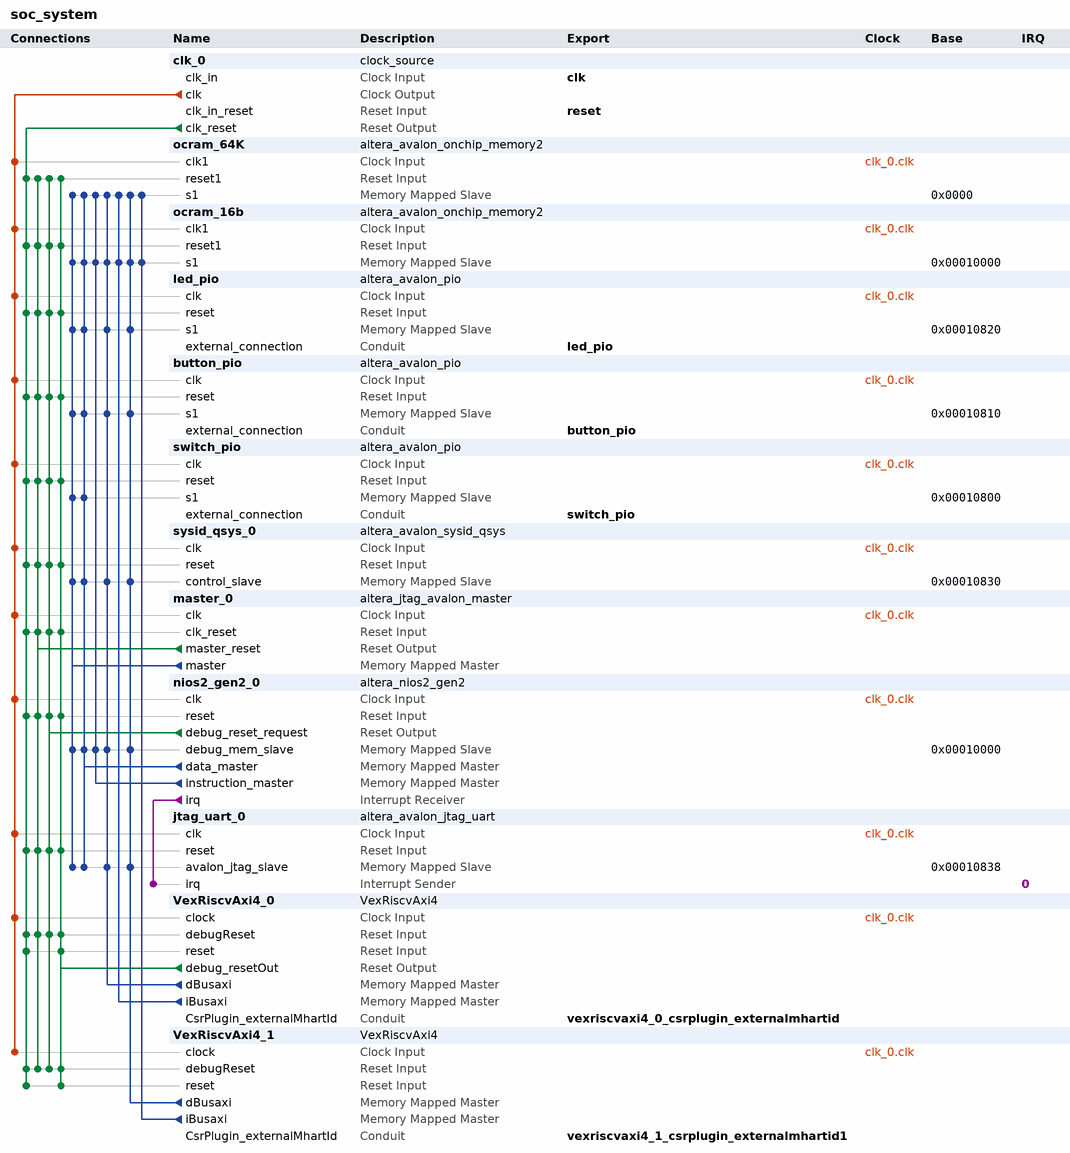
[diagram p0: system contents]
# Platform Designer (Qsys) system soc_system, Cyclone V 5CSEMA5F31C6
# Parameters at their usual value, and those the tool derives, are not listed.
package require -exact qsys 18.1
create_system soc_system
set_project_property DEVICE_FAMILY {Cyclone V}
set_project_property DEVICE 5CSEMA5F31C6

add_instance clk_0 clock_source 18.1
set_instance_parameter_value clk_0 clockFrequency 50000000

add_instance ocram_64K altera_avalon_onchip_memory2 18.1
set_instance_parameter_value ocram_64K dataWidth 32
set_instance_parameter_value ocram_64K dualPort false
set_instance_parameter_value ocram_64K initMemContent true
set_instance_parameter_value ocram_64K initializationFileName onchip_mem.hex
set_instance_parameter_value ocram_64K memorySize 65536

add_instance ocram_16b altera_avalon_onchip_memory2 18.1
set_instance_parameter_value ocram_16b dataWidth 32
set_instance_parameter_value ocram_16b dualPort false
set_instance_parameter_value ocram_16b initMemContent true
set_instance_parameter_value ocram_16b initializationFileName onchip_mem.hex
set_instance_parameter_value ocram_16b memorySize 16384

add_instance led_pio altera_avalon_pio 18.1
set_instance_parameter_value led_pio direction Output
set_instance_parameter_value led_pio width 4

add_instance button_pio altera_avalon_pio 18.1
set_instance_parameter_value button_pio direction Input
set_instance_parameter_value button_pio width 4

add_instance switch_pio altera_avalon_pio 18.1
set_instance_parameter_value switch_pio direction Input
set_instance_parameter_value switch_pio width 3

add_instance sysid_qsys_0 altera_avalon_sysid_qsys 18.1
set_instance_parameter_value sysid_qsys_0 id -569319920

add_instance master_0 altera_jtag_avalon_master 18.1

add_instance nios2_gen2_0 altera_nios2_gen2 18.1
set_instance_parameter_value nios2_gen2_0 dcache_size 2048
set_instance_parameter_value nios2_gen2_0 exceptionSlave ocram_64K.s1
set_instance_parameter_value nios2_gen2_0 icache_size 4096
set_instance_parameter_value nios2_gen2_0 impl Tiny
set_instance_parameter_value nios2_gen2_0 resetSlave ocram_64K.s1

add_instance jtag_uart_0 altera_avalon_jtag_uart 18.1
set_instance_parameter_value jtag_uart_0 simInteractiveOptions NO_INTERACTIVE_WINDOWS

add_instance VexRiscvAxi4_0 VexRiscvAxi4 1.0

add_instance VexRiscvAxi4_1 VexRiscvAxi4 1.0

# connections
add_connection clk_0.clk button_pio.clk clock
add_connection clk_0.clk jtag_uart_0.clk clock
add_connection clk_0.clk led_pio.clk clock
add_connection clk_0.clk master_0.clk clock
add_connection clk_0.clk nios2_gen2_0.clk clock
add_connection clk_0.clk ocram_16b.clk1 clock
add_connection clk_0.clk ocram_64K.clk1 clock
add_connection clk_0.clk switch_pio.clk clock
add_connection clk_0.clk sysid_qsys_0.clk clock
add_connection clk_0.clk VexRiscvAxi4_0.clock clock
add_connection clk_0.clk VexRiscvAxi4_1.clock clock
add_connection clk_0.clk_reset button_pio.reset reset
add_connection clk_0.clk_reset jtag_uart_0.reset reset
add_connection clk_0.clk_reset led_pio.reset reset
add_connection clk_0.clk_reset master_0.clk_reset reset
add_connection clk_0.clk_reset nios2_gen2_0.reset reset
add_connection clk_0.clk_reset ocram_16b.reset1 reset
add_connection clk_0.clk_reset ocram_64K.reset1 reset
add_connection clk_0.clk_reset switch_pio.reset reset
add_connection clk_0.clk_reset sysid_qsys_0.reset reset
add_connection clk_0.clk_reset VexRiscvAxi4_0.debugReset reset
add_connection clk_0.clk_reset VexRiscvAxi4_0.reset reset
add_connection clk_0.clk_reset VexRiscvAxi4_1.debugReset reset
add_connection clk_0.clk_reset VexRiscvAxi4_1.reset reset
add_connection master_0.master_reset button_pio.reset reset
add_connection master_0.master_reset jtag_uart_0.reset reset
add_connection master_0.master_reset led_pio.reset reset
add_connection master_0.master_reset master_0.clk_reset reset
add_connection master_0.master_reset nios2_gen2_0.reset reset
add_connection master_0.master_reset ocram_16b.reset1 reset
add_connection master_0.master_reset ocram_64K.reset1 reset
add_connection master_0.master_reset switch_pio.reset reset
add_connection master_0.master_reset sysid_qsys_0.reset reset
add_connection master_0.master_reset VexRiscvAxi4_0.debugReset reset
add_connection master_0.master_reset VexRiscvAxi4_1.debugReset reset
add_connection nios2_gen2_0.debug_reset_request button_pio.reset reset
add_connection nios2_gen2_0.debug_reset_request jtag_uart_0.reset reset
add_connection nios2_gen2_0.debug_reset_request led_pio.reset reset
add_connection nios2_gen2_0.debug_reset_request master_0.clk_reset reset
add_connection nios2_gen2_0.debug_reset_request nios2_gen2_0.reset reset
add_connection nios2_gen2_0.debug_reset_request ocram_16b.reset1 reset
add_connection nios2_gen2_0.debug_reset_request ocram_64K.reset1 reset
add_connection nios2_gen2_0.debug_reset_request switch_pio.reset reset
add_connection nios2_gen2_0.debug_reset_request sysid_qsys_0.reset reset
add_connection nios2_gen2_0.debug_reset_request VexRiscvAxi4_0.debugReset reset
add_connection nios2_gen2_0.debug_reset_request VexRiscvAxi4_1.debugReset reset
add_connection VexRiscvAxi4_0.debug_resetOut button_pio.reset reset
add_connection VexRiscvAxi4_0.debug_resetOut jtag_uart_0.reset reset
add_connection VexRiscvAxi4_0.debug_resetOut led_pio.reset reset
add_connection VexRiscvAxi4_0.debug_resetOut master_0.clk_reset reset
add_connection VexRiscvAxi4_0.debug_resetOut nios2_gen2_0.reset reset
add_connection VexRiscvAxi4_0.debug_resetOut ocram_16b.reset1 reset
add_connection VexRiscvAxi4_0.debug_resetOut ocram_64K.reset1 reset
add_connection VexRiscvAxi4_0.debug_resetOut switch_pio.reset reset
add_connection VexRiscvAxi4_0.debug_resetOut sysid_qsys_0.reset reset
add_connection VexRiscvAxi4_0.debug_resetOut VexRiscvAxi4_0.debugReset reset
add_connection VexRiscvAxi4_0.debug_resetOut VexRiscvAxi4_0.reset reset
add_connection VexRiscvAxi4_0.debug_resetOut VexRiscvAxi4_1.debugReset reset
add_connection VexRiscvAxi4_0.debug_resetOut VexRiscvAxi4_1.reset reset
add_connection master_0.master button_pio.s1 avalon
set_connection_parameter_value master_0.master/button_pio.s1 baseAddress 0x00010810
add_connection master_0.master jtag_uart_0.avalon_jtag_slave avalon
set_connection_parameter_value master_0.master/jtag_uart_0.avalon_jtag_slave baseAddress 0x00010838
add_connection master_0.master led_pio.s1 avalon
set_connection_parameter_value master_0.master/led_pio.s1 baseAddress 0x00010820
add_connection master_0.master nios2_gen2_0.debug_mem_slave avalon
set_connection_parameter_value master_0.master/nios2_gen2_0.debug_mem_slave baseAddress 0x00010000
add_connection master_0.master ocram_16b.s1 avalon
set_connection_parameter_value master_0.master/ocram_16b.s1 baseAddress 0x00010000
set_connection_parameter_value master_0.master/ocram_16b.s1 defaultConnection true
add_connection master_0.master ocram_64K.s1 avalon
set_connection_parameter_value master_0.master/ocram_64K.s1 baseAddress 0x0000
add_connection master_0.master switch_pio.s1 avalon
set_connection_parameter_value master_0.master/switch_pio.s1 baseAddress 0x00010800
add_connection master_0.master sysid_qsys_0.control_slave avalon
set_connection_parameter_value master_0.master/sysid_qsys_0.control_slave baseAddress 0x00010830
add_connection nios2_gen2_0.data_master button_pio.s1 avalon
set_connection_parameter_value nios2_gen2_0.data_master/button_pio.s1 baseAddress 0x00010810
add_connection nios2_gen2_0.data_master jtag_uart_0.avalon_jtag_slave avalon
set_connection_parameter_value nios2_gen2_0.data_master/jtag_uart_0.avalon_jtag_slave baseAddress 0x00010838
add_connection nios2_gen2_0.data_master led_pio.s1 avalon
set_connection_parameter_value nios2_gen2_0.data_master/led_pio.s1 baseAddress 0x00010820
add_connection nios2_gen2_0.data_master nios2_gen2_0.debug_mem_slave avalon
set_connection_parameter_value nios2_gen2_0.data_master/nios2_gen2_0.debug_mem_slave baseAddress 0x00010000
add_connection nios2_gen2_0.data_master ocram_16b.s1 avalon
set_connection_parameter_value nios2_gen2_0.data_master/ocram_16b.s1 baseAddress 0x00010000
set_connection_parameter_value nios2_gen2_0.data_master/ocram_16b.s1 defaultConnection true
add_connection nios2_gen2_0.data_master ocram_64K.s1 avalon
set_connection_parameter_value nios2_gen2_0.data_master/ocram_64K.s1 baseAddress 0x0000
add_connection nios2_gen2_0.data_master switch_pio.s1 avalon
set_connection_parameter_value nios2_gen2_0.data_master/switch_pio.s1 baseAddress 0x00010800
add_connection nios2_gen2_0.data_master sysid_qsys_0.control_slave avalon
set_connection_parameter_value nios2_gen2_0.data_master/sysid_qsys_0.control_slave baseAddress 0x00010830
add_connection nios2_gen2_0.instruction_master nios2_gen2_0.debug_mem_slave avalon
set_connection_parameter_value nios2_gen2_0.instruction_master/nios2_gen2_0.debug_mem_slave baseAddress 0x00010000
add_connection nios2_gen2_0.instruction_master ocram_16b.s1 avalon
set_connection_parameter_value nios2_gen2_0.instruction_master/ocram_16b.s1 baseAddress 0x00010000
set_connection_parameter_value nios2_gen2_0.instruction_master/ocram_16b.s1 defaultConnection true
add_connection nios2_gen2_0.instruction_master ocram_64K.s1 avalon
set_connection_parameter_value nios2_gen2_0.instruction_master/ocram_64K.s1 baseAddress 0x0000
add_connection VexRiscvAxi4_0.dBusaxi button_pio.s1 avalon
set_connection_parameter_value VexRiscvAxi4_0.dBusaxi/button_pio.s1 baseAddress 0x00010810
add_connection VexRiscvAxi4_0.dBusaxi jtag_uart_0.avalon_jtag_slave avalon
set_connection_parameter_value VexRiscvAxi4_0.dBusaxi/jtag_uart_0.avalon_jtag_slave baseAddress 0x00010838
add_connection VexRiscvAxi4_0.dBusaxi led_pio.s1 avalon
set_connection_parameter_value VexRiscvAxi4_0.dBusaxi/led_pio.s1 baseAddress 0x00010820
add_connection VexRiscvAxi4_0.dBusaxi nios2_gen2_0.debug_mem_slave avalon
set_connection_parameter_value VexRiscvAxi4_0.dBusaxi/nios2_gen2_0.debug_mem_slave baseAddress 0x00010000
add_connection VexRiscvAxi4_0.dBusaxi ocram_16b.s1 avalon
set_connection_parameter_value VexRiscvAxi4_0.dBusaxi/ocram_16b.s1 baseAddress 0x00010000
set_connection_parameter_value VexRiscvAxi4_0.dBusaxi/ocram_16b.s1 defaultConnection true
add_connection VexRiscvAxi4_0.dBusaxi ocram_64K.s1 avalon
set_connection_parameter_value VexRiscvAxi4_0.dBusaxi/ocram_64K.s1 baseAddress 0x0000
add_connection VexRiscvAxi4_0.dBusaxi sysid_qsys_0.control_slave avalon
set_connection_parameter_value VexRiscvAxi4_0.dBusaxi/sysid_qsys_0.control_slave baseAddress 0x00010830
add_connection VexRiscvAxi4_0.iBusaxi ocram_16b.s1 avalon
set_connection_parameter_value VexRiscvAxi4_0.iBusaxi/ocram_16b.s1 baseAddress 0x00010000
set_connection_parameter_value VexRiscvAxi4_0.iBusaxi/ocram_16b.s1 defaultConnection true
add_connection VexRiscvAxi4_0.iBusaxi ocram_64K.s1 avalon
set_connection_parameter_value VexRiscvAxi4_0.iBusaxi/ocram_64K.s1 baseAddress 0x0000
add_connection VexRiscvAxi4_1.dBusaxi button_pio.s1 avalon
set_connection_parameter_value VexRiscvAxi4_1.dBusaxi/button_pio.s1 baseAddress 0x00010810
add_connection VexRiscvAxi4_1.dBusaxi jtag_uart_0.avalon_jtag_slave avalon
set_connection_parameter_value VexRiscvAxi4_1.dBusaxi/jtag_uart_0.avalon_jtag_slave baseAddress 0x00010838
add_connection VexRiscvAxi4_1.dBusaxi led_pio.s1 avalon
set_connection_parameter_value VexRiscvAxi4_1.dBusaxi/led_pio.s1 baseAddress 0x00010820
add_connection VexRiscvAxi4_1.dBusaxi nios2_gen2_0.debug_mem_slave avalon
set_connection_parameter_value VexRiscvAxi4_1.dBusaxi/nios2_gen2_0.debug_mem_slave baseAddress 0x00010000
add_connection VexRiscvAxi4_1.dBusaxi ocram_16b.s1 avalon
set_connection_parameter_value VexRiscvAxi4_1.dBusaxi/ocram_16b.s1 baseAddress 0x00010000
set_connection_parameter_value VexRiscvAxi4_1.dBusaxi/ocram_16b.s1 defaultConnection true
add_connection VexRiscvAxi4_1.dBusaxi ocram_64K.s1 avalon
set_connection_parameter_value VexRiscvAxi4_1.dBusaxi/ocram_64K.s1 baseAddress 0x0000
add_connection VexRiscvAxi4_1.dBusaxi sysid_qsys_0.control_slave avalon
set_connection_parameter_value VexRiscvAxi4_1.dBusaxi/sysid_qsys_0.control_slave baseAddress 0x00010830
add_connection VexRiscvAxi4_1.iBusaxi ocram_16b.s1 avalon
set_connection_parameter_value VexRiscvAxi4_1.iBusaxi/ocram_16b.s1 baseAddress 0x00010000
set_connection_parameter_value VexRiscvAxi4_1.iBusaxi/ocram_16b.s1 defaultConnection true
add_connection VexRiscvAxi4_1.iBusaxi ocram_64K.s1 avalon
set_connection_parameter_value VexRiscvAxi4_1.iBusaxi/ocram_64K.s1 baseAddress 0x0000
add_connection nios2_gen2_0.irq jtag_uart_0.irq interrupt
set_connection_parameter_value nios2_gen2_0.irq/jtag_uart_0.irq irqNumber 0

# exported interfaces
add_interface button_pio conduit end
set_interface_property button_pio EXPORT_OF button_pio.external_connection
add_interface clk clock sink
set_interface_property clk EXPORT_OF clk_0.clk_in
add_interface led_pio conduit end
set_interface_property led_pio EXPORT_OF led_pio.external_connection
add_interface reset reset sink
set_interface_property reset EXPORT_OF clk_0.clk_in_reset
add_interface switch_pio conduit end
set_interface_property switch_pio EXPORT_OF switch_pio.external_connection
add_interface vexriscvaxi4_0_csrplugin_externalmhartid conduit end
set_interface_property vexriscvaxi4_0_csrplugin_externalmhartid EXPORT_OF VexRiscvAxi4_0.CsrPlugin_externalMhartId
add_interface vexriscvaxi4_1_csrplugin_externalmhartid1 conduit end
set_interface_property vexriscvaxi4_1_csrplugin_externalmhartid1 EXPORT_OF VexRiscvAxi4_1.CsrPlugin_externalMhartId

set_interconnect_requirement {$system} qsys_mm.clockCrossingAdapter HANDSHAKE
set_interconnect_requirement {$system} qsys_mm.enableEccProtection FALSE
set_interconnect_requirement {$system} qsys_mm.insertDefaultSlave FALSE
set_interconnect_requirement {$system} qsys_mm.maxAdditionalLatency 1

save_system soc_system.qsys
